# Altium schematic sheet MCU.SchDoc
size Legal
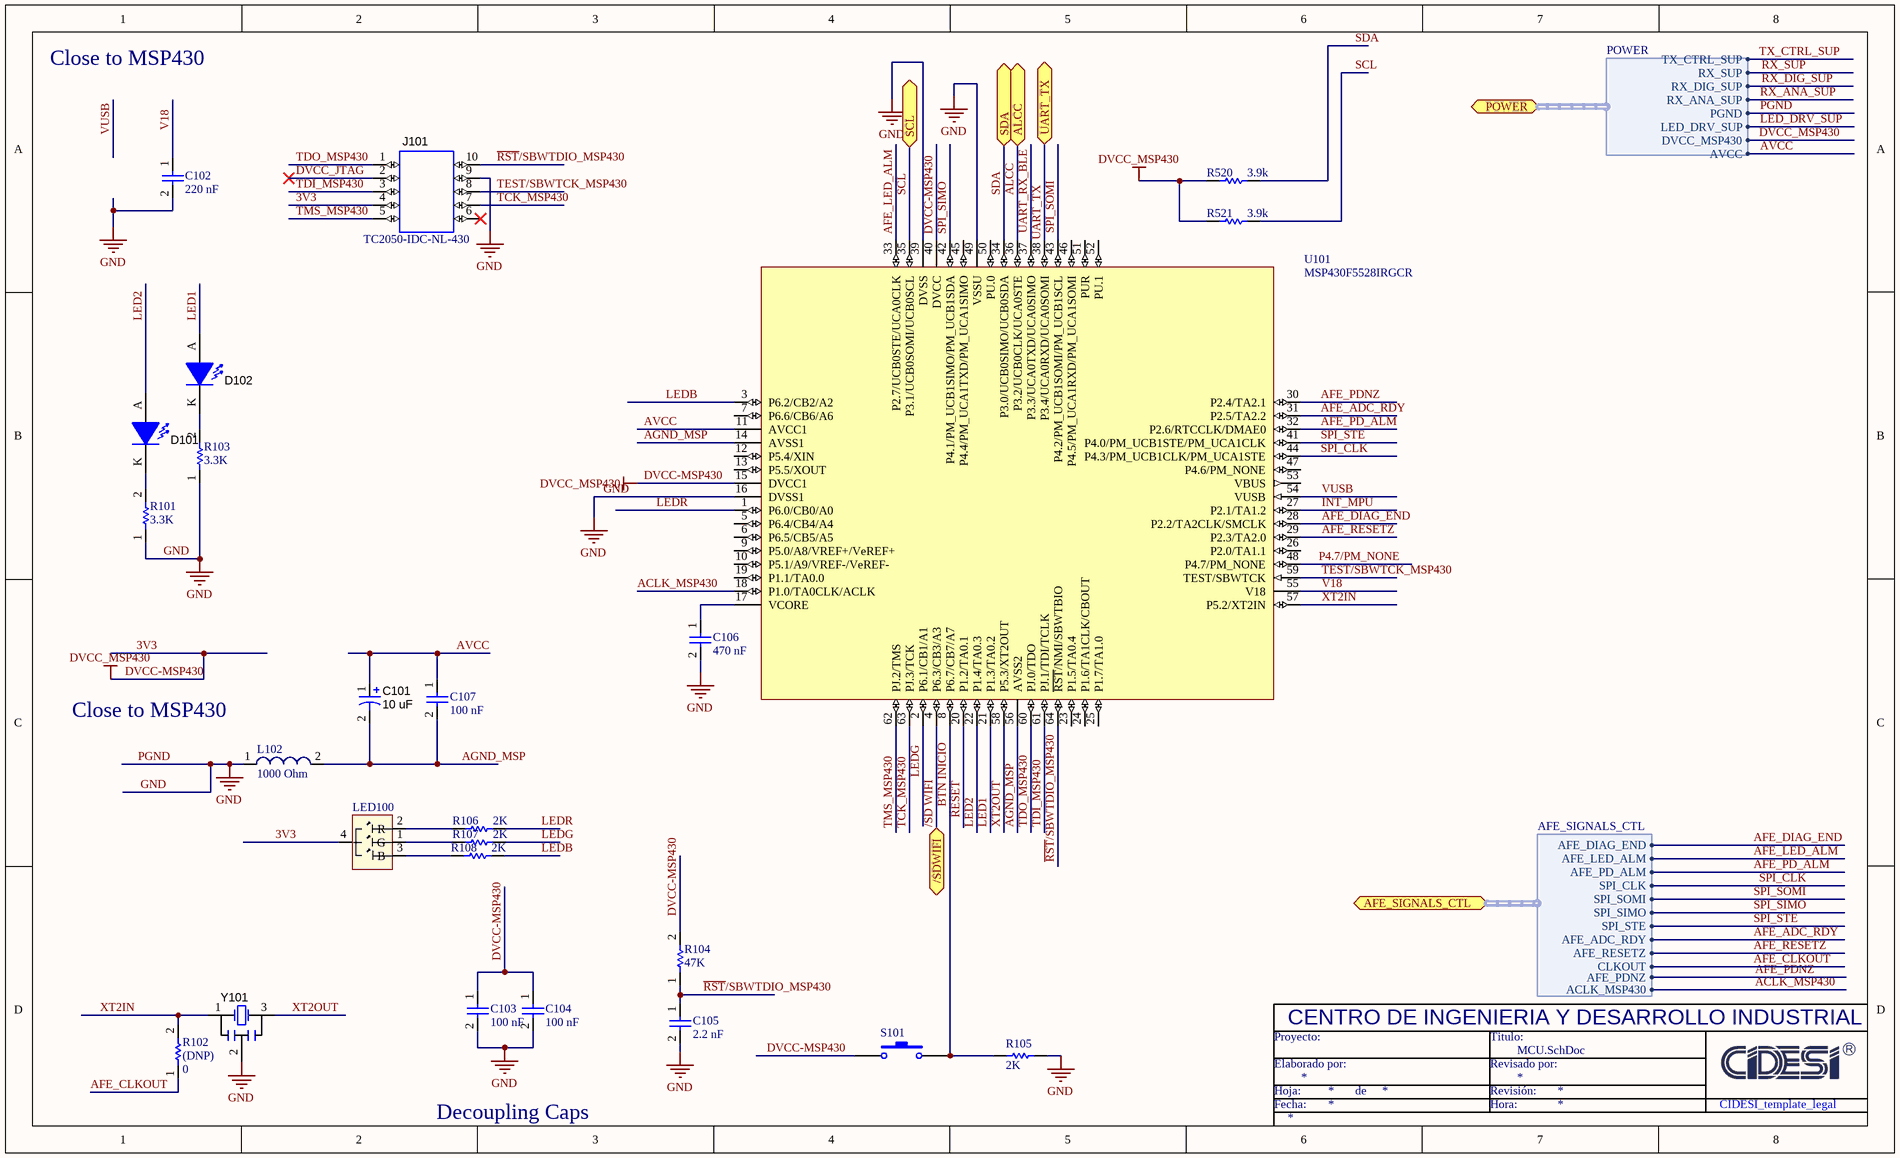
[diagram p0: MCU.SchDoc]

## Parts
C101  10 uF  [C0603_P]
C102  220 nF  [C0402]
C103  100 nF  [C0402]
C104  100 nF  [C0402]
C105  2.2 nF  [C0402]
C106  470 nF  [C0402]
C107  100 nF  [C0402]
D101  KPHHS-1005QBC-D-V  [LED_0402_BLUE]  (value not drawn)
D102  2290341  [LED_0402_GREEN]  (value not drawn)
J101  value TC2050-IDC-NL-430  [TC2050-IDC-NL]  (no BOM)
L102  1000 Ohm  [SMD 0402]
LED100  LED RGB AnodoComun  [LED-RGB 0606]  (value not drawn)
R101  3.3K  [0201]
R102  (DNP)  value 0  [0201]
R103  3.3K  [0201]
R104  47K  [0201]
R105  value 2K  [CR-0402]  (hidden comment: Res1)
R106  value 2K  [CR-0402]  (hidden comment: Res1)
R107  value 2K  [CR-0402]  (hidden comment: Res1)
R108  value 2K  [CR-0402]  (hidden comment: Res1)
R520  value 3.9k  [CR-0402]  (hidden comment: Res 3.9K)
R521  value 3.9k  [CR-0402]  (hidden comment: Res 3.9K)
S101  SW-PB  [TL3315]  (value not drawn)
U101  MSP430F5528IRGCR  [PVQFN-N64]
Y101  CSTCR4M00G15L99-R0  [CRYSTAL-2X4.5MM_3P]  (value not drawn)

## Ports
/SDWIFI (bidir), AFE_SIGNALS_CTL (harness AFE_SIGNALS_CTL), ALCC (bidir), POWER (harness POWER), SCL (bidir), SDA (bidir), UART_TX (bidir)

## Harnesses
POWER: AVCC, DVCC_MSP430, LED_DRV_SUP, PGND, RX_ANA_SUP, RX_DIG_SUP, RX_SUP, TX_CTRL_SUP
AFE_SIGNALS_CTL: CLKOUT, AFE_RESETZ, AFE_ADC_RDY, SPI_STE, SPI_SIMO, SPI_SOMI, SPI_CLK, AFE_PD_ALM, AFE_LED_ALM, AFE_DIAG_END, AFE_PDNZ, ACLK_MSP430

## Nets
3V3: C103.1 C104.1 J101.4 LED100.4 R104.2 R520.2 R521.2 S101.1 U101.15(DVCC1) U101.40(DVCC) ; port POWER.DVCC_MSP430  [also labelled DVCC-MSP430, DVCC_MSP430]
GND: C102.2 C103.2 C104.2 C105.2 C106.2 J101.9 L102.1 R101.1 R103.1 R105.1 U101.16(DVSS1) U101.39(DVSS) U101.49(VSSU) Y101.2 ; port POWER.PGND  [also labelled PGND]
/SD WIFI: U101.4(P6.3/CB3/A3) ; port /SDWIFI
ACLK_MSP430: U101.18(P1.0/TA0CLK/ACLK) ; port AFE_SIGNALS_CTL.ACLK_MSP430
AFE_ADC_RDY: U101.31(P2.5/TA2.2) ; port AFE_SIGNALS_CTL.AFE_ADC_RDY
AFE_CLKOUT: R102.1 ; port AFE_SIGNALS_CTL.CLKOUT
AFE_DIAG_END: U101.28(P2.2/TA2CLK/SMCLK) ; port AFE_SIGNALS_CTL.AFE_DIAG_END
AFE_LED_ALM: U101.33(P2.7/UCB0STE/UCA0CLK) ; port AFE_SIGNALS_CTL.AFE_LED_ALM
AFE_PD_ALM: U101.32(P2.6/RTCCLK/DMAE0) ; port AFE_SIGNALS_CTL.AFE_PD_ALM
AFE_PDNZ: U101.30(P2.4/TA2.1) ; port AFE_SIGNALS_CTL.AFE_PDNZ
AFE_RESETZ: U101.29(P2.3/TA2.0) ; port AFE_SIGNALS_CTL.AFE_RESETZ
AGND_MSP: C101.2(-) C107.2 L102.2 U101.14(AVSS1) U101.56(AVSS2)
ALCC: U101.36(P3.2/UCB0CLK/UCA0STE) ; port ALCC
AVCC: C101.1(+) C107.1 U101.11(AVCC1) ; port POWER.AVCC
BTN INICIO: R105.2 S101.2 U101.8(P6.7/CB7/A7)
DVCC_JTAG: J101.2
INT_MPU: U101.27(P2.1/TA1.2)
LED1: D102.A U101.21(P1.3/TA0.2)
LED2: D101.A U101.22(P1.4/TA0.3)
LED_DRV_SUP: port POWER.LED_DRV_SUP
LEDB: R108.1 U101.3(P6.2/CB2/A2)
LEDG: R107.1 U101.2(P6.1/CB1/A1)
LEDR: R106.1 U101.1(P6.0/CB0/A0)
P4.7/PM_NONE: U101.48(P4.7/PM_NONE)
~{RST}/SBWTDIO_MSP430: C105.1 J101.10 R104.1 U101.64(~{RST}/NMI/SBWTBIO)
RESET: U101.20(P1.2/TA0.1)
RX_ANA_SUP: port POWER.RX_ANA_SUP
RX_DIG_SUP: port POWER.RX_DIG_SUP
RX_SUP: port POWER.RX_SUP
SCL: R521.1 U101.35(P3.1/UCB0SOMI/UCB0SCL) ; port SCL
SDA: R520.1 U101.34(P3.0/UCB0SIMO/UCB0SDA) ; port SDA
SPI_CLK: U101.44(P4.3/PM_UCB1CLK/PM_UCA1STE) ; port AFE_SIGNALS_CTL.SPI_CLK
SPI_SIMO: U101.42(P4.1/PM_UCB1SIMO/PM_UCB1SDA) ; port AFE_SIGNALS_CTL.SPI_SIMO
SPI_SOMI: U101.43(P4.2/PM_UCB1SOMI/PM_UCB1SCL) ; port AFE_SIGNALS_CTL.SPI_SOMI
SPI_STE: U101.41(P4.0/PM_UCB1STE/PM_UCA1CLK) ; port AFE_SIGNALS_CTL.SPI_STE
TCK_MSP430: J101.7 U101.63(PJ.3/TCK)
TDI_MSP430: J101.3 U101.61(PJ.1/TDI/TCLK)
TDO_MSP430: J101.1 U101.60(PJ.0/TDO)
TEST/SBWTCK_MSP430: J101.8 U101.59(TEST/SBWTCK)
TMS_MSP430: J101.5 U101.62(PJ.2/TMS)
TX_CTRL_SUP: port POWER.TX_CTRL_SUP
UART_RX_BLE: U101.37(P3.3/UCA0TXD/UCA0SIMO)
UART_TX: U101.38(P3.4/UCA0RXD/UCA0SOMI) ; port UART_TX
V18: C102.1 U101.55(V18)
VUSB: U101.54(VUSB)
XT2IN: R102.2 U101.57(P5.2/XT2IN) Y101.1
XT2OUT: U101.58(P5.3/XT2OUT) Y101.3
NetC106_1: C106.1 U101.17(VCORE)
NetD101_K: D101.K R101.2
NetD102_K: D102.K R103.2
NetLED100_1: LED100.1(G) R107.2
NetLED100_2: LED100.2(R) R106.2
NetLED100_3: LED100.3(B) R108.2

Not connected (* = marked no-connect by the designer): J101 6*; U101 5(P6.4/CB4/A4) 6(P6.5/CB5/A5) 7(P6.6/CB6/A6) 9(P5.0/A8/VREF+/VeREF+) 10(P5.1/A9/VREF-/VeREF-) 12(P5.4/XIN) 13(P5.5/XOUT) 19(P1.1/TA0.0) 23(P1.5/TA0.4) 24(P1.6/TA1CLK/CBOUT) 25(P1.7/TA1.0) 26(P2.0/TA1.1) 45(P4.4/PM_UCA1TXD/PM_UCA1SIMO) 46(P4.5/PM_UCA1RXD/PM_UCA1SOMI) 47(P4.6/PM_NONE) 50(PU.0) 51(PUR) 52(PU.1) 53(VBUS)

## Notes on the sheet
- Close to MSP430
- (near L102) Close to MSP430
- Decoupling Caps
- Proyecto:
- CENTRO DE INGENIERIA Y DESARROLLO INDUSTRIAL
- Titulo:
- Fecha:
- Hoja:
- Elaborado por:
- de
- Hora:
- Revisión:
- Revisado por:
- CIDESI_template_legal

## Library data of the parts
C101 = F981A106MMA: NICHICON - F981A106MMA - CAPACITOR TANT, 10UF, 10V 20%; Product Range: NICHICON - F98 Series; Capacitance: 10; Capacitor Case Style: 0603 ^1608 Metric]; ESR: 7.5; Value: 10 uF; Supplier 1: Farnell; Stock 1: 9201; Pricing 1: 1=0.282, 10=0.236, 100=0.169, 250=0.148, 500=0.131, 1000=0.117 (GBP); Capacitance Tolerance: ± 20%; Voltage Rating: 10; Operating Temperature Max: 125; Series: F98; ComponentLink1URL: http://www.nichicon.co.jp/english/products/pdfs/e-f98.pdf; ComponentLink1Description: http://www.nichicon.co.jp/english/products/pdfs/e-f98.pdf; Supplier Part Number 1: 1853431; Manufacturer 1: NICHICON; Manufacturer Part Number 1: F981A106MMA; RoHS 1: YES; Description 1: NICHICON - F981A106MMA - CAPACITOR TANT, 10UF, 10V 20%; Supplier 2: Mouser; Supplier Part Number 2: 647-F981A106MMA
C102 = C1005X7R1C224K050BC: TDK - C1005X7R1C224K050BC - CAP CERAMIC, 0.22UF, 16V, X7R, 0402; Supplier 1: Farnell; Stock 1: 13525; Pricing 1: 1=0.021, 10=0.012, 100=0.01, 1000=0.009, 4000=0.009, 8000=0.009 (GBP); ComponentLink1URL: http://product.tdk.com/capacitor/mlcc/en/documents/mlcc_commercial_general_en.pdf; ComponentLink1Description: http://product.tdk.com/capacitor/mlcc/en/documents/mlcc_commercial_general_en.pdf; Supplier Part Number 1: 2394245; Manufacturer 1: TDK; Manufacturer Part Number 1: C1005X7R1C224K050BC; RoHS 1: YES; Description 1: TDK - C1005X7R1C224K050BC - CAP CERAMIC, 0.22UF, 16V, X7R, 0402; Value: 220 nF; Supplier 2: Mouser; Supplier Part Number 2: 810-C1005X7R1C224K
C103 C104 C107 = C1005X7R1H104M050BB: TDK - C1005X7R1H104M050BB - CAP CERAMIC, 0.1UF, 50V, X7R, 0402; Value: 100 nF; Supplier 1: Farnell; Stock 1: 15712; Pricing 1: 1=0.021, 10=0.012, 100=0.01, 1000=0.009, 4000=0.009, 8000=0.009 (GBP); ComponentLink1URL: http://product.tdk.com/capacitor/mlcc/en/documents/mlcc_commercial_general_en.pdf; ComponentLink1Description: http://product.tdk.com/capacitor/mlcc/en/documents/mlcc_commercial_general_en.pdf; Supplier Part Number 1: 2354090; Manufacturer 1: TDK; Manufacturer Part Number 1: C1005X7R1H104M050BB; RoHS 1: YES; Description 1: TDK - C1005X7R1H104M050BB - CAP CERAMIC, 0.1UF, 50V, X7R, 0402; Supplier 2: Mouser; Supplier Part Number 2: 810-C1005X7R1H104M
C105 = C1005X7R1H222K050BA: TDK - C1005X7R1H222K050BA - CAPACITOR CERAMIC 2200PF, 50V, X7R, 10%, 0402; Value: 2.2 nF; Supplier 1: Farnell; Stock 1: 9840; Pricing 1: 1=0.004, 10=0.002, 100=0.002, 1000=0.002, 2500=0.002, 10000=0.002 (GBP); ComponentLink1URL: http://www.farnell.com/datasheets/1571323.pdf; ComponentLink1Description: http://www.farnell.com/datasheets/1571323.pdf; ComponentLink2URL: http://www.farnell.com/datasheets/1718611.pdf; ComponentLink2Description: http://www.farnell.com/datasheets/1718611.pdf; Supplier Part Number 1: 1844139; Manufacturer 1: TDK; Manufacturer Part Number 1: C1005X7R1H222K050BA; RoHS 1: YES; Description 1: TDK - C1005X7R1H222K050BA - CAPACITOR CERAMIC 2200PF, 50V, X7R, 10%, 0402; Supplier 2: Mouser; Supplier Part Number 2: 810-C1005X7R1H222K
C106 = C1005X5R1E474K050BB: TDK - C1005X5R1E474K050BB - CAP CERAMIC, 0.47UF, 25V, X5R, 0402; Product Range: TDK - C Series; Capacitance: 0.47; Capacitance Tolerance: ± 10%; Dielectric Characteristic: X5; Voltage Rating: 25; Capacitor Case Style: 0402 ^1005 Metric]; Value: 470 nF; Supplier 1: Farnell; Stock 1: 17199; Pricing 1: 1=0.019, 10=0.009, 100=0.009, 1000=0.008, 2500=0.008, 10000=0.008 (GBP); Packaging: Cut Tape; MSL: -; ComponentLink1URL: http://product.tdk.com/capacitor/mlcc/en/documents/mlcc_commercial_general_en.pdf; ComponentLink1Description: http://product.tdk.com/capacitor/mlcc/en/documents/mlcc_commercial_general_en.pdf; Supplier Part Number 1: 2354077; Manufacturer 1: TDK; Manufacturer Part Number 1: C1005X5R1E474K050BB; RoHS 1: YES; Description 1: TDK - C1005X5R1E474K050BB - CAP CERAMIC, 0.47UF, 25V, X5R, 0402; Supplier 2: Mouser; Supplier Part Number 2: 810-C1005X5R1E474K
D101 = LNJ947W8CRA: KINGBRIGHT - KPHHS-1005QBC-D-V - LED, 0402, BLUE; Luminous Intensity: 100; Viewing Angle: 120°; Forward Current If: 20; Forward Voltage: 3.3; LED Mounting: SMD; Lens Shape: Rectangular; Wavelength Typ: 468; SVHC: No SVHC (16-Dec-2013; Supplier 1: Farnell; Supplier Part Number 1: 2290337; Manufacturer 1: KINGBRIGHT; Manufacturer Part Number 1: KPHHS-1005QBC-D-V; RoHS 1: YES; Description 1: KINGBRIGHT - KPHHS-1005QBC-D-V - LED, 0402, BLUE; Stock 1: 863; Pricing 1: 1=0.15, 10=0.135, 50=0.122, 100=0.12, 250=0.108, 500=0.0972, 500=0.0875, 3000=0.0787 (GBP); Bulb Size: -; LED Colour: Blue; Packaging: Each; MSL: MSL 3 - 168 hours; ComponentLink1URL: http://www.farnell.com/datasheets/1683504.pdf; ComponentLink1Description: http://www.farnell.com/datasheets/1683504.pdf; Supplier 2: Mouser; Supplier Part Number 2: 667-LNJ947W8CRA
D102 = APHHS1005CGCK: KINGBRIGHT - KPHHS-1005MGCK - LED, 0402, GREEN; Luminous Intensity: 60; Viewing Angle: 120°; Forward Current If: 20; Forward Voltage: 2.1; LED Mounting: SMD; Lens Shape: Rectangular; Wavelength Typ: 574; SVHC: No SVHC (16-Dec-2013; Supplier 1: Farnell; Supplier Part Number 1: 2290341; Manufacturer 1: KINGBRIGHT; Manufacturer Part Number 1: KPHHS-1005MGCK; RoHS 1: YES; Description 1: KINGBRIGHT - KPHHS-1005MGCK - LED, 0402, GREEN; Stock 1: 2970; Pricing 1: 1=0.173, 10=0.162, 50=0.151, 100=0.14, 250=0.13, 500=0.12, 500=0.108, 3000=0.0859 (GBP); Bulb Size: -; LED Colour: Green; Packaging: Each; MSL: MSL 3 - 168 hours; ComponentLink1URL: http://www.farnell.com/datasheets/1683503.pdf; ComponentLink1Description: http://www.farnell.com/datasheets/1683503.pdf; Supplier 2: Mouser; Supplier Part Number 2: 604-APHHS1005CGCK
J101 = TC2050-IDC-NL-430: CONNECTOR, PLUG OF NAILS CABLE, DUAL ROW, VERTICAL, 10-PIN; MANUFACTURER: TAG CONNECT; POPULATE: N; PART NUMBER: TC2050-IDC-NL-430; CONSIGNED: N
L102 = WE-CBF HF 0402, 742841210: SMD EMI Suppression Ferrite Beads WE-CBF HF, Z= 1000 Ohm; Manufacturer: Würth Elektronik eiSos GmbH; Manufacturer 1: WURTH ELEKTRONIK; Description 1: WURTH ELEKTRONIK - 742841210 - FERRITE BEAD, 1.8OHM, 50MA, 0402; partNo: 742841210; Impedance: 1000 Ohm; ComponentLink1Description: Manufacturer; ComponentLink1URL: http://www.we-online.de; Created by: Christin Zierenner; Created Date: May 2009; ComponentLink2Description: Datasheet; ComponentLink2URL: http://www.we-online.de/katalog/media/pdf/742841210.pdf; Supplier 1: Farnell; Supplier Part Number 1: 1748573; Manufacturer Part Number 1: 742841210; RoHS 1: YES; Stock 1: 220; Pricing 1: 1=0.31, 10=0.219, 50=0.19, 100=0.158, 250=0.126 (GBP); ComponentLink3URL: http://www.farnell.com/datasheets/1696154.pdf; ComponentLink3Description: http://www.farnell.com/datasheets/1696154.pdf; ComponentLink4URL: http://www.farnell.com/cad/1670055.zip; ComponentLink4Description: http://www.farnell.com/cad/1670055.zip; Supplier 2: Mouser; Supplier Part Number 2: 710-742841210
R101 R103 = CRCW02013K30FNED: VISHAY DALE - CRCW02013K30FNED - RESISTOR, THICK FILM, 3.3 KOHM, 50 mW, 1%, FULL REEL; Value: 3.3K; Supplier 1: Farnell; Stock 1: 9995; Pricing 1: 10000=0.007, 20000=0.007, 30000=0.006, 50000=0.006 (GBP); ComponentLink1URL: http://www.farnell.com/datasheets/1700795.pdf; ComponentLink1Description: http://www.farnell.com/datasheets/1700795.pdf; Supplier Part Number 1: 2322357; Manufacturer 1: VISHAY DALE; Manufacturer Part Number 1: CRCW02013K30FNED; RoHS 1: YES; Description 1: VISHAY DALE - CRCW02013K30FNED - RESISTOR, THICK FILM, 3.3 KOHM, 50 mW, 1%, FULL REEL
R102 = CRCW02010000Z0ED: VISHAY DALE - CRCW02010000Z0ED - RESISTOR, CHIP, JUMPER, ZERO OHM, 50mW, FULL REEL; Supplier 1: Farnell; Stock 1: 19995; Pricing 1: 10000=0.017, 20000=0.016, 30000=0.015 (GBP); ComponentLink1URL: http://www.vishay.com/docs/20035/dcrcwe3.pdf; ComponentLink1Description: http://www.vishay.com/docs/20035/dcrcwe3.pdf; Supplier Part Number 1: 2316008; Manufacturer 1: VISHAY DALE; Manufacturer Part Number 1: CRCW02010000Z0ED; RoHS 1: YES; Description 1: VISHAY DALE - CRCW02010000Z0ED - RESISTOR, CHIP, JUMPER, ZERO OHM, 50mW, FULL REEL; Supplier 2: Mouser; Supplier Part Number 2: 71-CRCW02010000Z0ED
R104 = CRCW020147K0FNED: VISHAY DALE - CRCW020147K0FNED - RESISTOR, THICK FILM, 47 KOHM, 50 mW, 1%, FULL REEL; Product Range: VISHAY - CRCW Series; Resistance: 47; Power Rating: 50; Resistor Case Style: 0201 ^0603 Metric]; Value: 47K; Supplier 1: Farnell; Stock 1: 9995; Pricing 1: 10000=0.007, 20000=0.007, 30000=0.006, 50000=0.006 (GBP); Resistance Tolerance: ± 1%; Resistor Element Type: Thick Film; MSL: -; ComponentLink1URL: http://www.farnell.com/datasheets/1700795.pdf; ComponentLink1Description: http://www.farnell.com/datasheets/1700795.pdf; Supplier Part Number 1: 2322005; Manufacturer 1: VISHAY DALE; Manufacturer Part Number 1: CRCW020147K0FNED; RoHS 1: YES; Description 1: VISHAY DALE - CRCW020147K0FNED - RESISTOR, THICK FILM, 47 KOHM, 50 mW, 1%, FULL REEL
R105-R108 = Res1: Resistor; Supplier 1: Newark; Supplier Part Number 1: 52K6788; Supplier 2: Mouser; Supplier Part Number 2: 71-CRCW0402-2.0K-E3
R520 R521 = Res1_1: Resistor; Supplier 1: Newark; Supplier Part Number 1: 52K6579; Supplier 2: Mouser; Supplier Part Number 2: 71-CRCW0402-1.62K-E3
S101 = SW-PB: Switch; Supplier 1: Newark; Supplier Part Number 1: 15N4507; Supplier 2: Mouser; Supplier Part Number 2: 612-TL3315NF160Q
U101 = MSP430F5528IRGC: TEXAS INSTRUMENTS - MSP430F5528IRGCR - MCU, 16BIT, MSP430, 25MHZ, VQFN-64; Program Memory Size: 128; RAM Memory Size: 10; CPU Speed: 25; No. of I/O's: 47; MCU Case Style: VQFN; No. of Pins: 64; Embedded Interface Type: I2; Supply Voltage Min: 1.8; Supply Voltage Max: 3.6; Core Size: 16; Peripherals: ADC, Comparator, PWM, Timer; SVHC: No SVHC (16-Dec-2013; Supplier 1: Farnell; Stock 1: 1985; Pricing 1: 2000=2.45 (GBP); Controller Family/Series: MSP430F5; Packaging: Tape & Reel; MSL: MSL 3 - 168 hours; Operating Temperature Max: 85; Operating Temperature Min: -40; ComponentLink1URL: http://www.farnell.com/datasheets/1726495.pdf; ComponentLink1Description: http://www.farnell.com/datasheets/1726495.pdf; ComponentLink2URL: http://www.farnell.com/datasheets/1698556.pdf; ComponentLink2Description: http://www.farnell.com/datasheets/1698556.pdf; Supplier Part Number 1: 2325742; Manufacturer 1: TEXAS INSTRUMENTS; Manufacturer Part Number 1: MSP430F5528IRGCR; RoHS 1: YES; Description 1: TEXAS INSTRUMENTS - MSP430F5528IRGCR - MCU, 16BIT, MSP430, 25MHZ, VQFN-64; Supplier 2: Mouser; Supplier Part Number 2: 595-MSP430F5528IRGCR
Y101 = CSTCR4M00G15L99-R0: CRYSTAL, PIEZO CERAMIC RESONATOR, 4.00 MHz,  +/-0.1%, 39pF, SMD; MANUFACTURER: MURATA; POPULATE: Y; CONSIGNED: N; VALUE: 4MHz; Description 1: Resonators 4MHZ; Frequency: 4 MHz; Tolerance: 0.5 %; Brand: Murata Electronics; PART NUMBER: CSTCR4M00G15L99-R0; Supplier 1: Mouser; Supplier Part Number 1: 81-CSTCR4M00G15L99R0; Manufacturer 1: Murata; Manufacturer Part Number 1: CSTCR4M00G15L99-R0; RoHS 1: RoHS Compliant; Category: Resonators; Stock 1: 3676; Pricing 1: 1=0.945, 10=0.667, 100=0.597, 1000=0.502, 3000=0.471, 9000=0.455, 24000=0.439 (AUD); Dimensions: 1.4 mm W x 4.1 mm L x 1.15 mm H; Packaging: Reel; Series: CSTCR; Termination Style: SMD/SMT; Standard Pack Qty: 3000; RoHS - Mouser: Y; Minimum Order Quantity: 1; Reeling: True; ComponentLink1URL: http://search.murata.co.jp/Ceramy/CatalogAction.do?sHinnm=?&nbsp&sNHinnm=CSTCR4M00G15L99-R0&sNhin_key=CSTCR4M00G15L99-R0&sLang=en&sParam=CSTCR; ComponentLink1Description: http://search.murata.co.jp/Ceramy/CatalogAction.do?sHinnm=?&nbsp&sNHinnm=CSTCR4M00G15L99-R0&sNhin_key=CSTCR4M00G15L99-R0&sLang=en&sParam=CSTCR
LED100 = LED RGB AnodoComun: Supplier 1: Newark; Supplier Part Number 1: 75R0622; Supplier 2: Mouser; Supplier Part Number 2: 645-598-8710-307F